# EasyEDA schematic FAN_CONTROLER_LDO.json
TITLE: Sheet_1; REV: 1.0; Date: 2025-11-13; Sheet: 1/1; Drawn By: AmirB; Company: Your Company
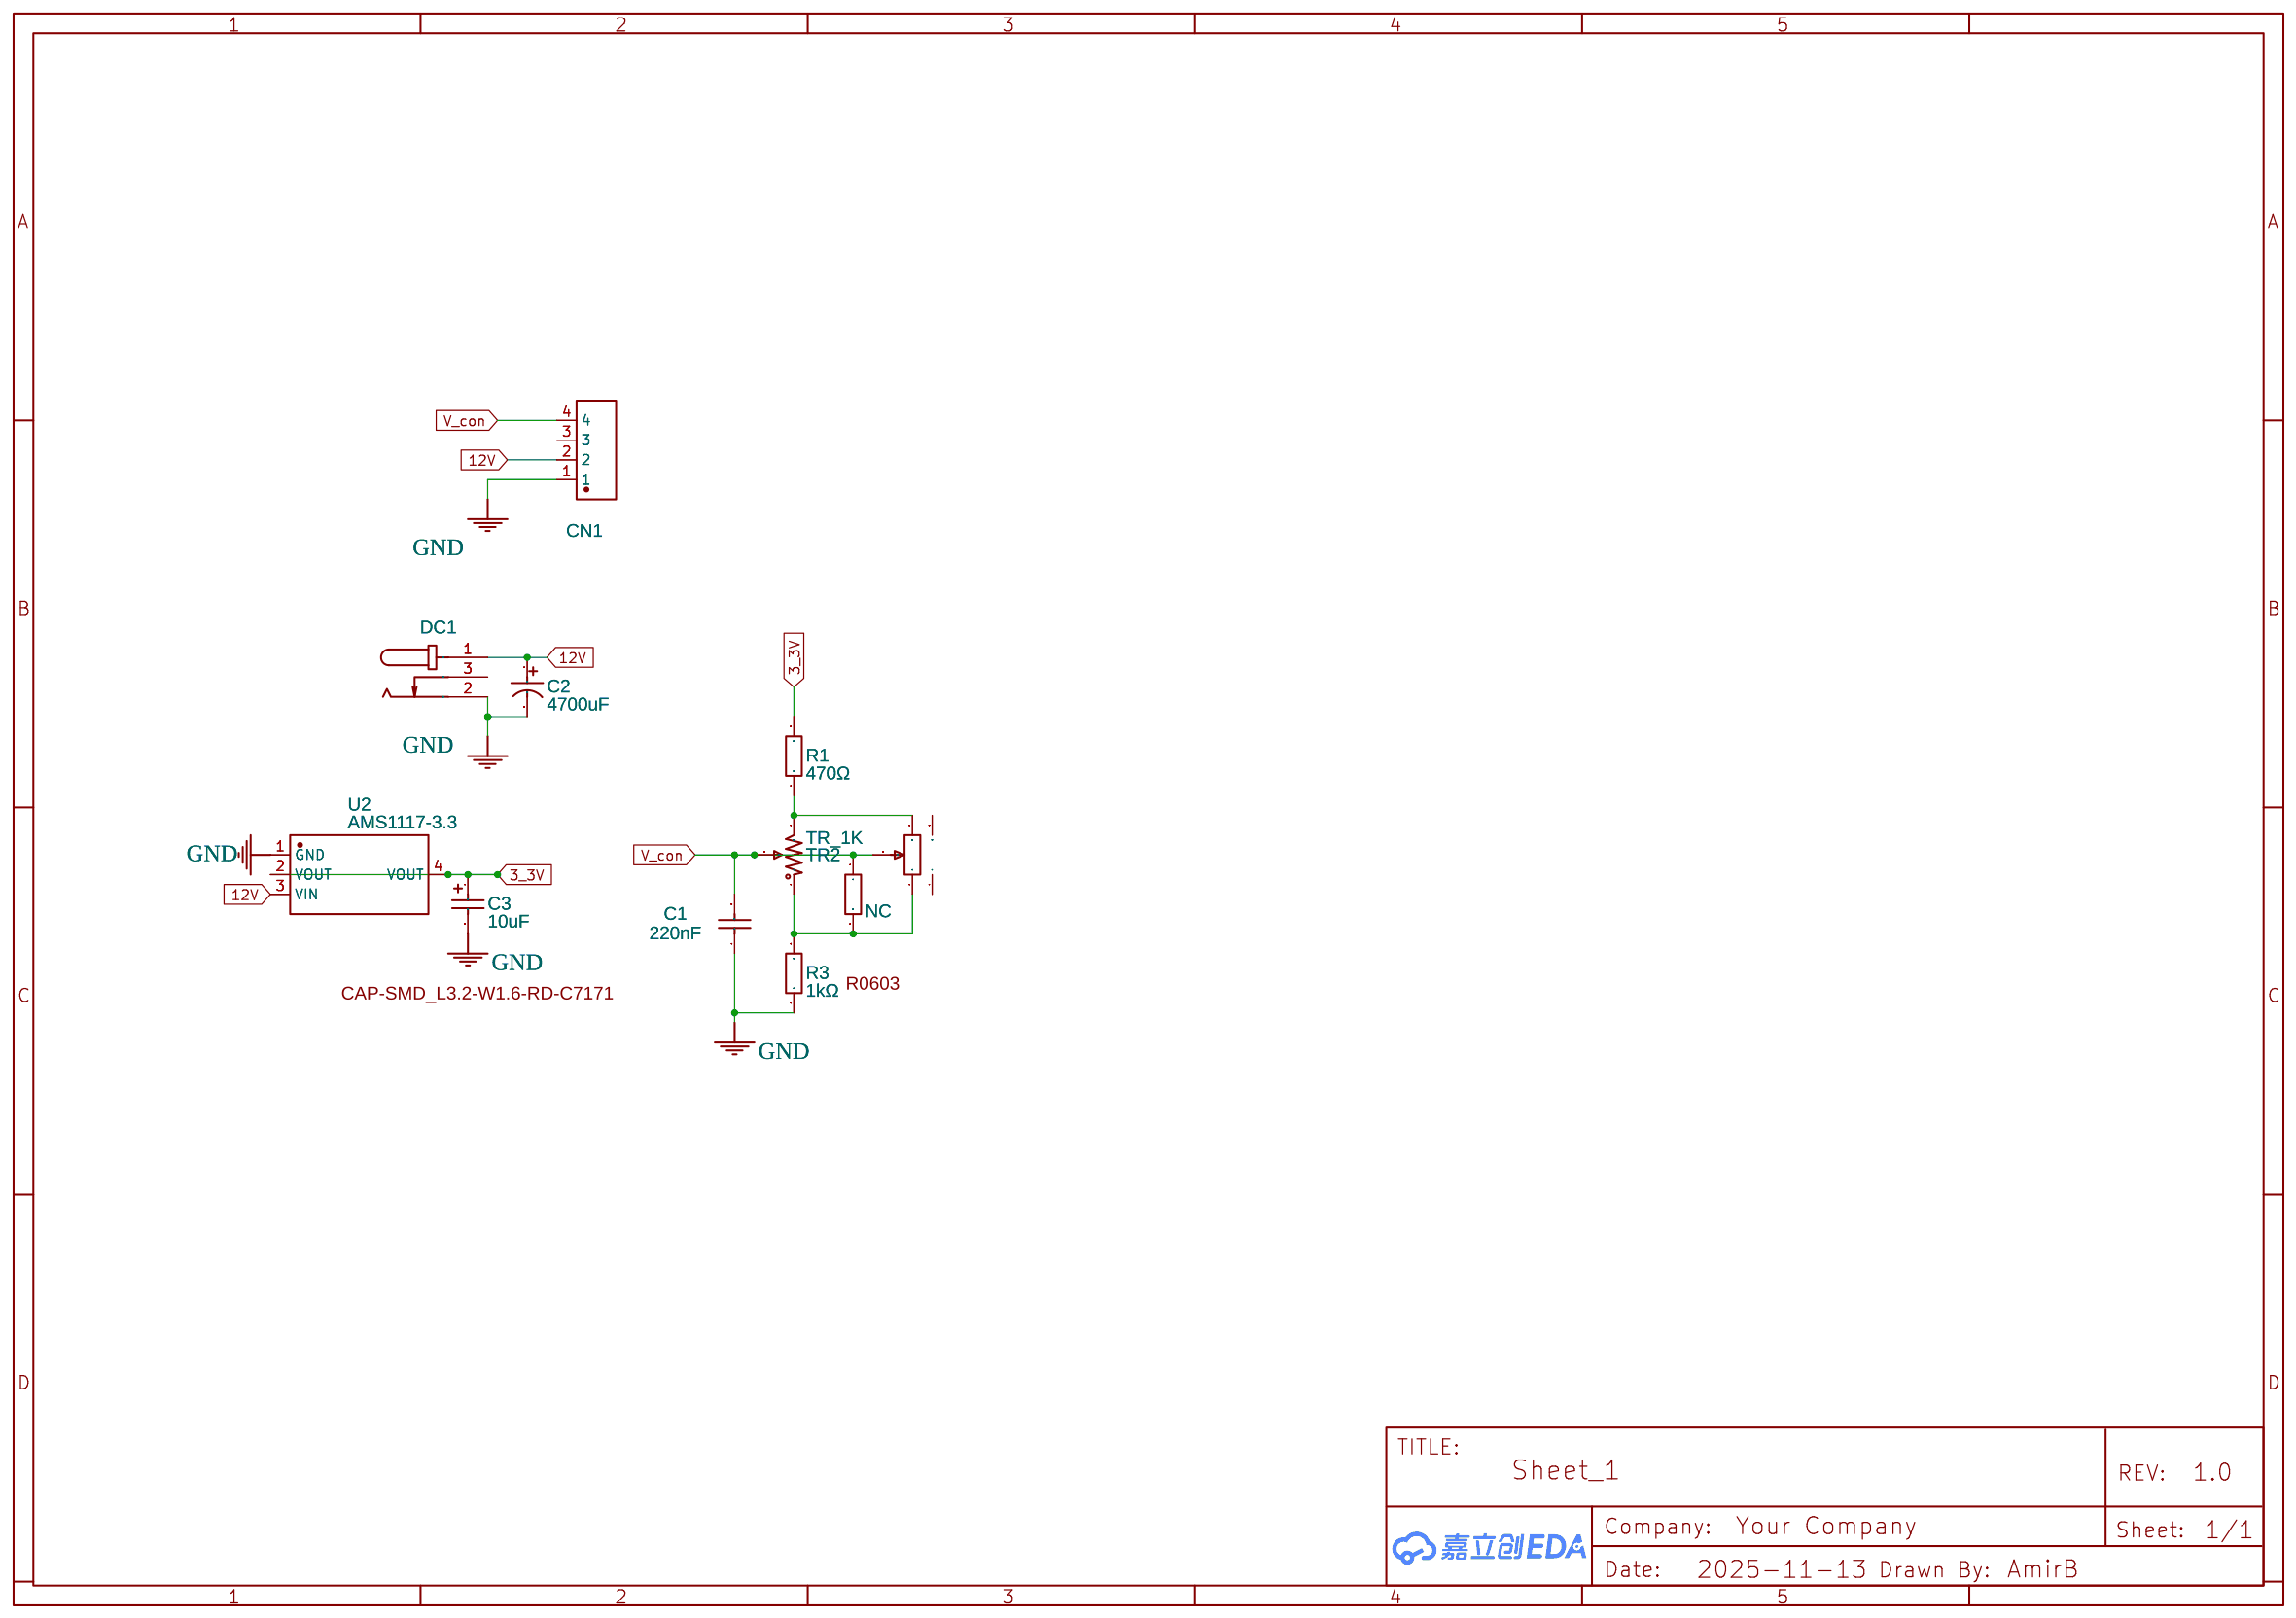
[diagram p0: schematic sheet]

## Parts
C1  220nF  [C0603]
C2  4700uF  [CAP-TH_BD12.5-P5.00-D0.6-FD]
C3  10uF  [CAP-SMD_L3.2-W1.6-RD-C7171]
CN1  KF2510-4AGW-GW  [CONN-TH_4P-P2.54_CAX_KF2510-4AGW-GW]
DC1  DC  [DC-IN-TH_DC005]
NC  NC  [R0603]
POT_2  POT_1K  [RES-ADJ-TH_RV09]
R1  470Ω  [R0603]
R3  1kΩ  [R0603]
TR2  TR_1K  [RES-ADJ-TH_3296W]
U2  AMS1117-3.3  [SOT-223-3_L6.5-W3.4-P2.30-LS7.0-BR]

## Library data of the parts
C1 = CL10B224KA8NNNC: Supplier: LCSC; Manufacturer: SAMSUNG(三星); Supplier Part: C21120; JLCPCB Part Class: Basic Part; Package Display: No
C2 = 4700uF16V: Supplier: LCSC; Manufacturer: Chengx(承兴); Supplier Part: C29884; JLCPCB Part Class: Extended Part; Package Display: No
C3 = TAJA106K016RNJ: Supplier: LCSC; Manufacturer: Kyocera AVX; Supplier Part: C7171; JLCPCB Part Class: Basic Part; Package Display: Yes
CN1 = KF2510-4AGW-GW: Contributor: LCSC; Supplier: LCSC; Supplier Part: C722747; Manufacturer: CAX(创都); JLCPCB Part Class: Extended Part; Package Display: No
DC1 = DC005-2.0MM: Supplier: LCSC; Manufacturer: SOFNG; Supplier Part: C111567; Package Display: No
NC = 0603WAF1002T5E: Supplier: LCSC; Manufacturer: UNI-ROYAL(厚声); Supplier Part: C25804; Resistance (Ohms): 10K; JLCPCB Part Class: Basic Part; Package Display: No
POT_2 = 长柄旋转电位器: Supplier: LCSC; Supplier Part: C2874842; Manufacturer: null; JLCPCB Part Class: Extended Part; Contributor: LCSC; Package Display: No
R1 = 0603WAF4700T5E: Supplier: LCSC; Manufacturer: UNI-ROYAL(厚声); Supplier Part: C23179; JLCPCB Part Class: Basic Part; Package Display: No
R3 = 0603WAF1001T5E: Supplier: LCSC; Manufacturer: UNI-ROYAL(厚声); Supplier Part: C21190; JLCPCB Part Class: Basic Part; Package Display: Yes
TR2 = 3296W-1-202LF_C49190458: Supplier: LCSC; Supplier Part: C49190458; Manufacturer: JIERR(捷而瑞); JLCPCB Part Class: Extended Part; Contributor: lcsc; Package Display: No
U2 = AMS1117-3.3: sourceId: dwIGgezVh; Supplier: LCSC; Manufacturer: AMS; Supplier Part: C6186; JLCPCB Part Class: Basic Part; Package Display: No

## Nets
12V: C2.1 CN1.2 DC1.1 U2.3(VIN)
GND: C1.1 C2.2 C3.2 CN1.1 DC1.2 R3.1 U2.1(GND)
3_3V: C3.1 R1.2 U2.2(VOUT) U2.4(VOUT)
V_con: C1.2 CN1.4 NC.1 POT_2.2 TR2.2
Net-(NC-2): NC.2 POT_2.1 R3.2 TR2.1
Net-(POT_2-3): POT_2.3 R1.1 TR2.3

Not connected (* = marked no-connect by the designer): CN1 3; DC1 3; POT_2 4 5
